# Altium schematic sheet USB-FLASH.SchDoc
size A4; SheetNumber: 10; SheetTotal: 16
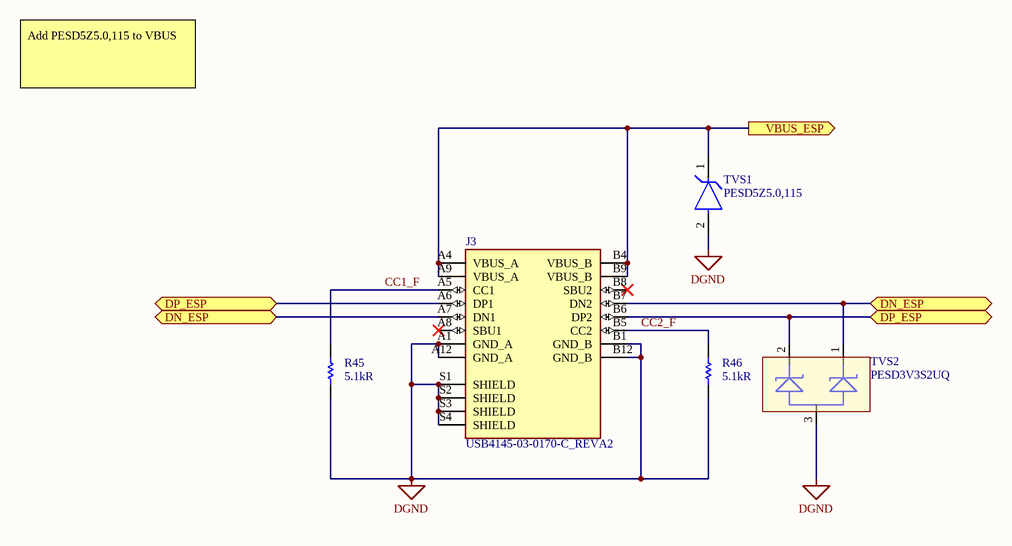
[diagram p0: USB-FLASH.SchDoc]

## Parts
J3  USB4145-03-0170-C_REVA2  [GCT_USB4145-03-0170-C_REVA2]
R45  value 5.1kR  [RESC1005X40X25ML10T10]  (hidden comment: RK73H1ETTP5101F)
R46  value 5.1kR  [RESC1005X40X25ML10T10]  (hidden comment: RK73H1ETTP5101F)
TVS1  PESD5Z5.0,115  [DIO_BAS716,115]
TVS2  PESD3V3S2UQ  [SOT663_NXP]

## Ports
DN_ESP (bidir), DP_ESP (bidir), VBUS_ESP (out)

## Nets
DGND: J3.A1(GND_A) J3.A12(GND_A) J3.B1(GND_B) J3.B12(GND_B) J3.S1(SHIELD) J3.S2(SHIELD) J3.S3(SHIELD) J3.S4(SHIELD) R45.1 R46.1 TVS1.2 TVS2.3
CC1_F: J3.A5(CC1) R45.2
CC2_F: J3.B5(CC2) R46.2
DN_ESP: J3.A7(DN1) J3.B7(DN2) TVS2.1 ; port DN_ESP
DP_ESP: J3.A6(DP1) J3.B6(DP2) TVS2.2 ; port DP_ESP
VBUS_ESP: J3.A4(VBUS_A) J3.A9(VBUS_A) J3.B4(VBUS_B) J3.B9(VBUS_B) TVS1.1 ; port VBUS_ESP

Not connected (* = marked no-connect by the designer): J3 A8(SBU1)* B8(SBU2)*

## Notes on the sheet
- Add PESD5Z5.0,115 to VBUS

## Library data of the parts
J3 = CMP-349-000000-01-A-2: Value: *; Availability: Unavailable; Pin Count: 20; Price: None; Package: None; Source: USB4145-03-0170-C_REVA2.SchLib; Design Item ID: USB4145-03-0170-C_REVA2; Component Type: Standard; MP: USB4145-03-0170-C_REVA2
R45 R46 = CMP-2002-04046-1: Manufacturer: KOA Speer; Part Number: RK73H1ETTP5101F
TVS1 = CMP-x00209-4: Trans Voltage Suppressor Diode, 180W, 5V V(RWM), Unidirectional, 1 Element, Silicon; Manufacturer: Nexperia; Template: NX_SOD_523_2; Mounting: SMD; Category: Diodes; Package: SOD_523_2
TVS2 = CMP-356-000001-01-A-1: No Description Available; Mfr_Name: NXP; Component Type: Standard; Source: PESD3V3S2UQ.SchLib; Pin Count: 3; Digi-Key_Part_Number_2: 568-4519-2-ND; Digi-Key_Part_Number_1: 568-4519-1-ND; Design Item ID: PESD3V3S2UQ; Digi-Key_Part_Number_3: 568-4519-6-ND